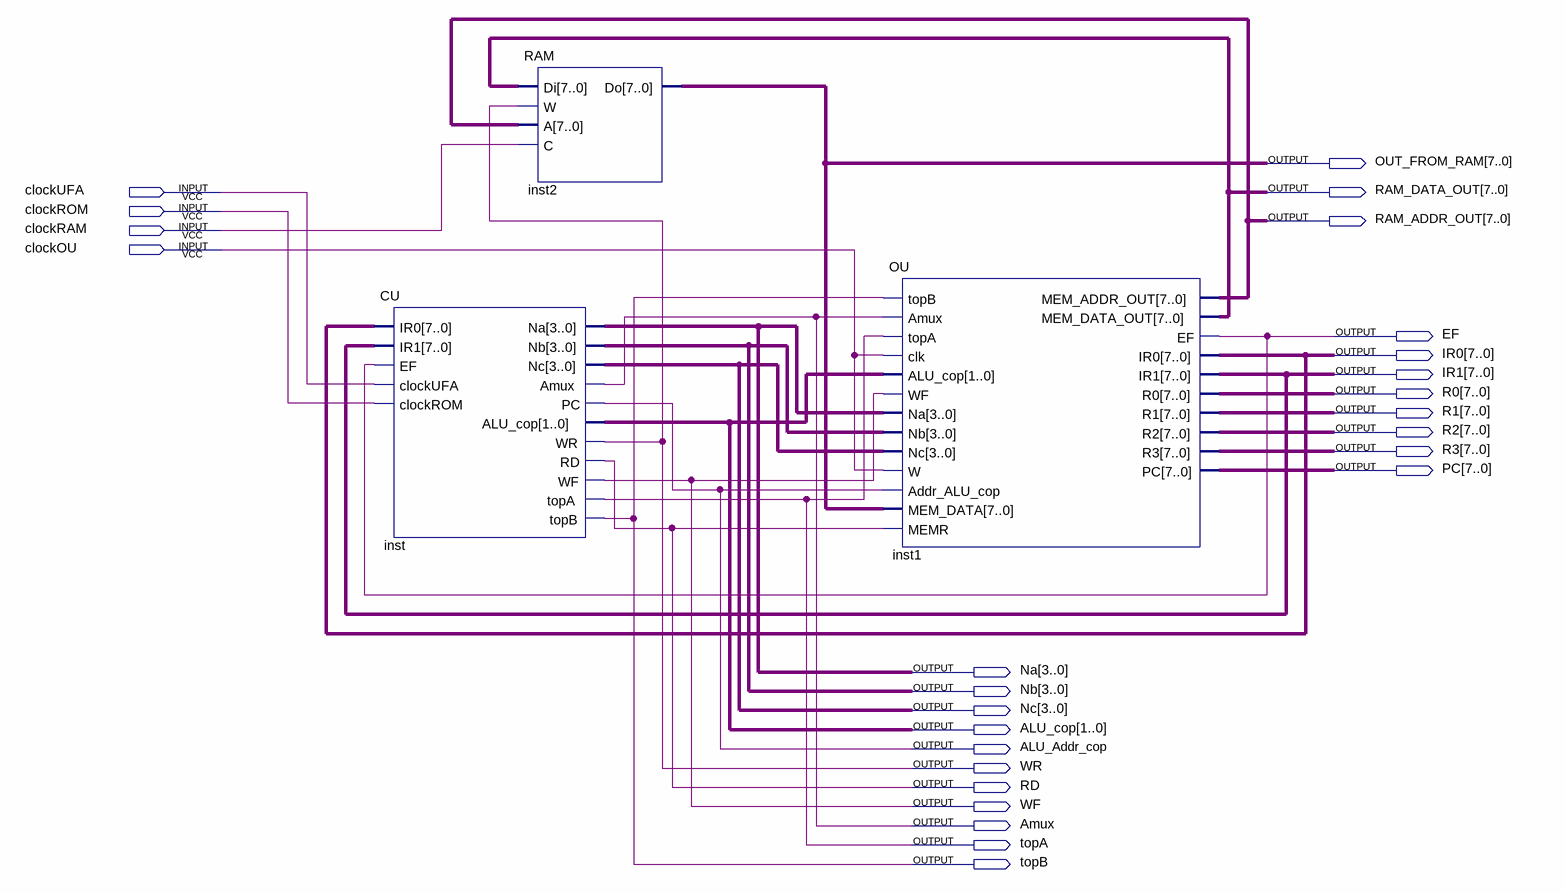
[diagram p0: schematic sheet]
// Quartus schematic CPU.bdf as structural Verilog: 3 symbols, 26 pins
module CPU (
  input  clockUFA,
  input  clockROM,
  input  clockRAM,
  input  clockOU,
  output [7:0] OUT_FROM_RAM,
  output [7:0] RAM_DATA_OUT,
  output [7:0] RAM_ADDR_OUT,
  output EF,
  output [7:0] IR0,
  output [7:0] IR1,
  output [7:0] R0,
  output [7:0] R1,
  output [7:0] R2,
  output [7:0] R3,
  output [7:0] PC,
  output [3:0] Na,
  output [3:0] Nb,
  output [3:0] Nc,
  output [1:0] ALU_cop,
  output ALU_Addr_cop,
  output WR,
  output RD,
  output WF,
  output Amux,
  output topA,
  output topB
);

  CU inst (
    .IR0(IR0), .IR1(IR1), .EF(EF), .clockUFA(clockUFA), .clockROM(clockROM), .Na(Na), .Nb(Nb), .Nc(Nc),
    .Amux(Amux), .PC(ALU_Addr_cop), .ALU_cop(ALU_cop), .WR(WR), .RD(RD), .WF(WF), .topA(topA), .topB(topB));
  RAM inst2 (.Di(RAM_DATA_OUT), .W(WR), .A(RAM_ADDR_OUT), .C(clockRAM), .Do(OUT_FROM_RAM));
  OU inst1 (
    .topB(topB), .Amux(Amux), .topA(topA), .clk(clockOU), .ALU_cop(ALU_cop), .WF(WF), .Na(Na), .Nb(Nb),
    .Nc(Nc), .W(clockOU), .Addr_ALU_cop(ALU_Addr_cop), .MEM_DATA(OUT_FROM_RAM), .MEMR(RD),
    .MEM_ADDR_OUT(RAM_ADDR_OUT), .MEM_DATA_OUT(RAM_DATA_OUT), .EF(EF), .IR0(IR0), .IR1(IR1), .R0(R0),
    .R1(R1), .R2(R2), .R3(R3), .PC(PC));
endmodule
